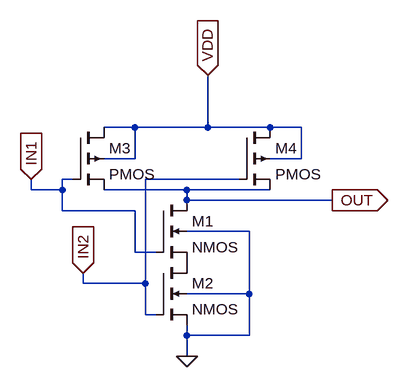
[diagram p0: schematic NAND2.asc]
NAND2.asc, the LTspice schematic file:
Version 4.1
SHEET 1 880 680
WIRE 80 128 32 128
WIRE 192 128 192 48
WIRE 192 128 80 128
WIRE 288 128 192 128
WIRE 336 128 288 128
WIRE 80 176 80 128
WIRE 80 176 32 176
WIRE 336 176 336 128
WIRE 336 176 288 176
WIRE -16 208 -32 208
WIRE 240 208 96 208
WIRE -80 224 -80 208
WIRE -32 224 -32 208
WIRE -32 224 -80 224
WIRE 160 224 32 224
WIRE 288 224 160 224
WIRE 160 240 160 224
WIRE 384 240 160 240
WIRE -32 256 -32 224
WIRE 80 256 -32 256
WIRE 256 288 160 288
WIRE 80 320 80 256
WIRE 112 320 80 320
WIRE 0 368 0 352
WIRE 96 368 96 208
WIRE 96 368 0 368
WIRE 256 384 256 288
WIRE 256 384 160 384
WIRE 96 416 96 368
WIRE 112 416 96 416
WIRE 160 448 160 432
WIRE 256 448 256 384
WIRE 256 448 160 448
WIRE 160 480 160 448
FLAG 160 480 0
FLAG 384 240 OUT
IOPIN 384 240 Out
FLAG -80 208 IN1
IOPIN -80 208 In
FLAG 0 352 IN2
IOPIN 0 352 In
FLAG 192 48 VDD
IOPIN 192 48 In
SYMBOL nmos4 112 240 R0
SYMATTR InstName M1
SYMBOL nmos4 112 336 R0
SYMATTR InstName M2
SYMBOL pmos4 -16 128 R0
SYMATTR InstName M3
SYMBOL pmos4 240 128 R0
SYMATTR InstName M4

The netlist it stands for:
* NAND2.asc
M1 OUT IN1 P001 0 NMOS
M2 P001 IN2 0 0 NMOS
M3 VDD IN1 OUT VDD PMOS
M4 VDD IN2 OUT VDD PMOS
.model NMOS NMOS
.model PMOS PMOS
.lib standard.mos
.backanno
.end